# EAGLE design Adapter-TenX-CurrentSink (EAGLE 7.7.0)
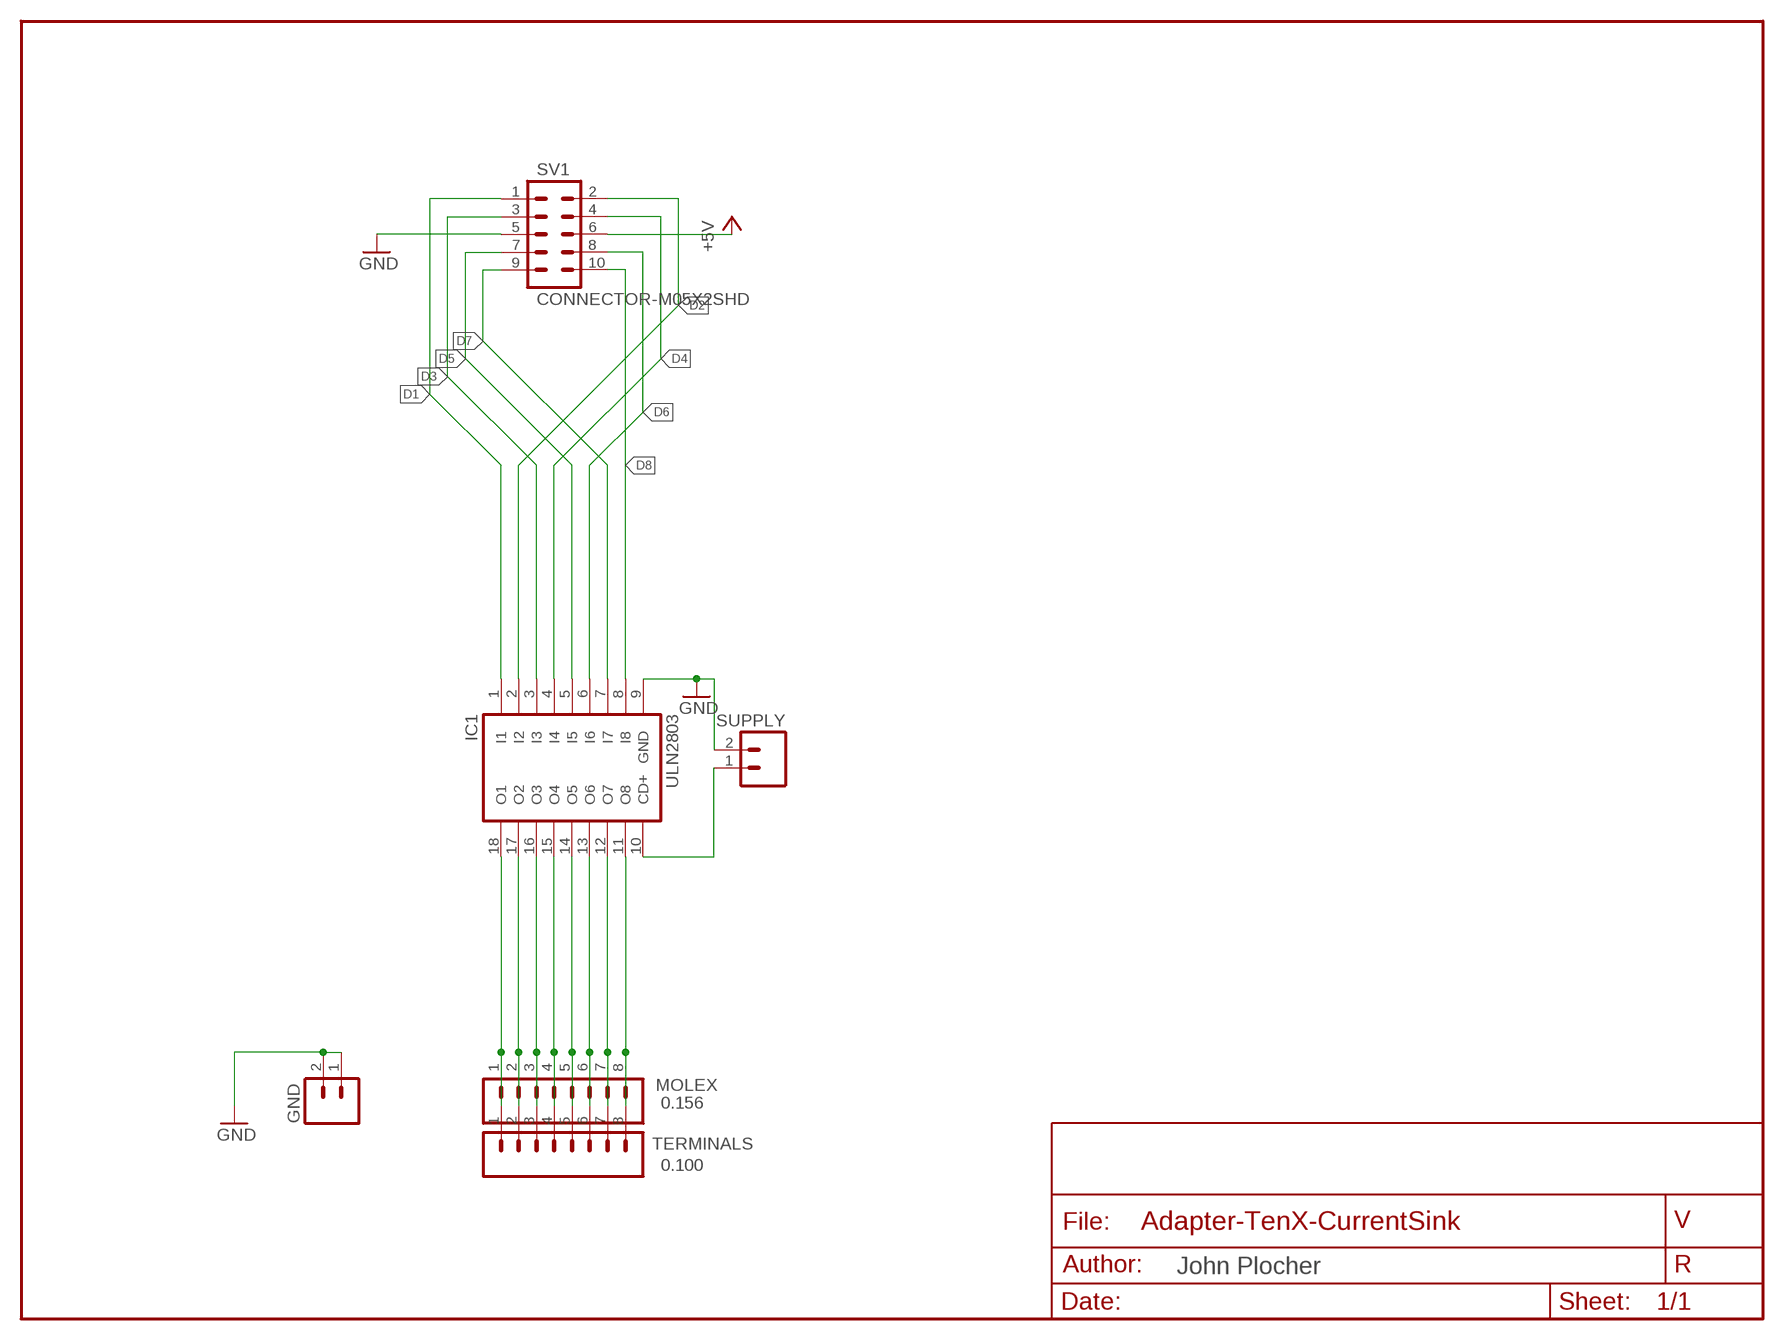
[diagram p0: schematic, sheet 1]

## Parts
GND  M02POLAR_LOCK  [MOLEX-1X2_LOCK]
IC1  ULN2803  ULN2803A  [DIL18]
MOLEX  0.156  CONNECTOR-M081.56-M  [KK-156-8-M]
SUPPLY  M02POLAR_LOCK  [MOLEX-1X2_LOCK]
SV1  CONNECTOR-M05X2SHD  [2X5-SHROUDED]
TERMINALS  0.100  CONNECTOR-M08LOCK_LONGPADS  [1X08_LOCK_LONGPADS]

## Nets
+5V: SV1.6
D1: IC1.1(I1) SV1.1
D2: IC1.2(I2) SV1.2
D3: IC1.3(I3) SV1.3
D4: IC1.4(I4) SV1.4
D5: IC1.5(I5) SV1.7
D6: IC1.6(I6) SV1.8
D7: IC1.7(I7) SV1.9
D8: IC1.8(I8) SV1.10
GND: GND.1 GND.2 IC1.9(GND) SUPPLY.2 SV1.5
N$1: IC1.10(CD+) SUPPLY.1
N$9: IC1.18(O1) MOLEX.1 TERMINALS.1
N$10: IC1.17(O2) MOLEX.2 TERMINALS.2
N$11: IC1.16(O3) MOLEX.3 TERMINALS.3
N$12: IC1.15(O4) MOLEX.4 TERMINALS.4
N$13: IC1.14(O5) MOLEX.5 TERMINALS.5
N$14: IC1.13(O6) MOLEX.6 TERMINALS.6
N$15: IC1.12(O7) MOLEX.7 TERMINALS.7
N$16: IC1.11(O8) MOLEX.8 TERMINALS.8

## Library data of the parts
GND SUPPLY = SparkFun:M02: Header 2 Standard 2-pin 0.1" header. Use with straight break away headers (SKU : PRT-00116), right angle break away headers (PRT-00553), swiss pins (PRT-00743), machine pins (PRT-00117), and female headers (PRT-00115). Molex polarized connector foot print use with SKU : PRT-08233 with associated crimp pins and housings.
IC1 = uln-udn:ULN2803A: DRIVER ARRAY
MOLEX TERMINALS = SPCoast:CONNECTOR-M08: Header 8 Standard 8-pin 0.1" header. Use with straight break away headers (SKU : PRT-00116), right angle break away headers (PRT-00553), swiss pins (PRT-00743), machine pins (PRT-00117), and female headers (PRT-00115).
SV1 = SPCoast:CONNECTOR-M05X2: Header 5x2 Standard 10-pin dual row 0.1" header. Commonly used with AVR-ISP. Use with Spark Fun Electronics SKU: PRT-00778

## Board
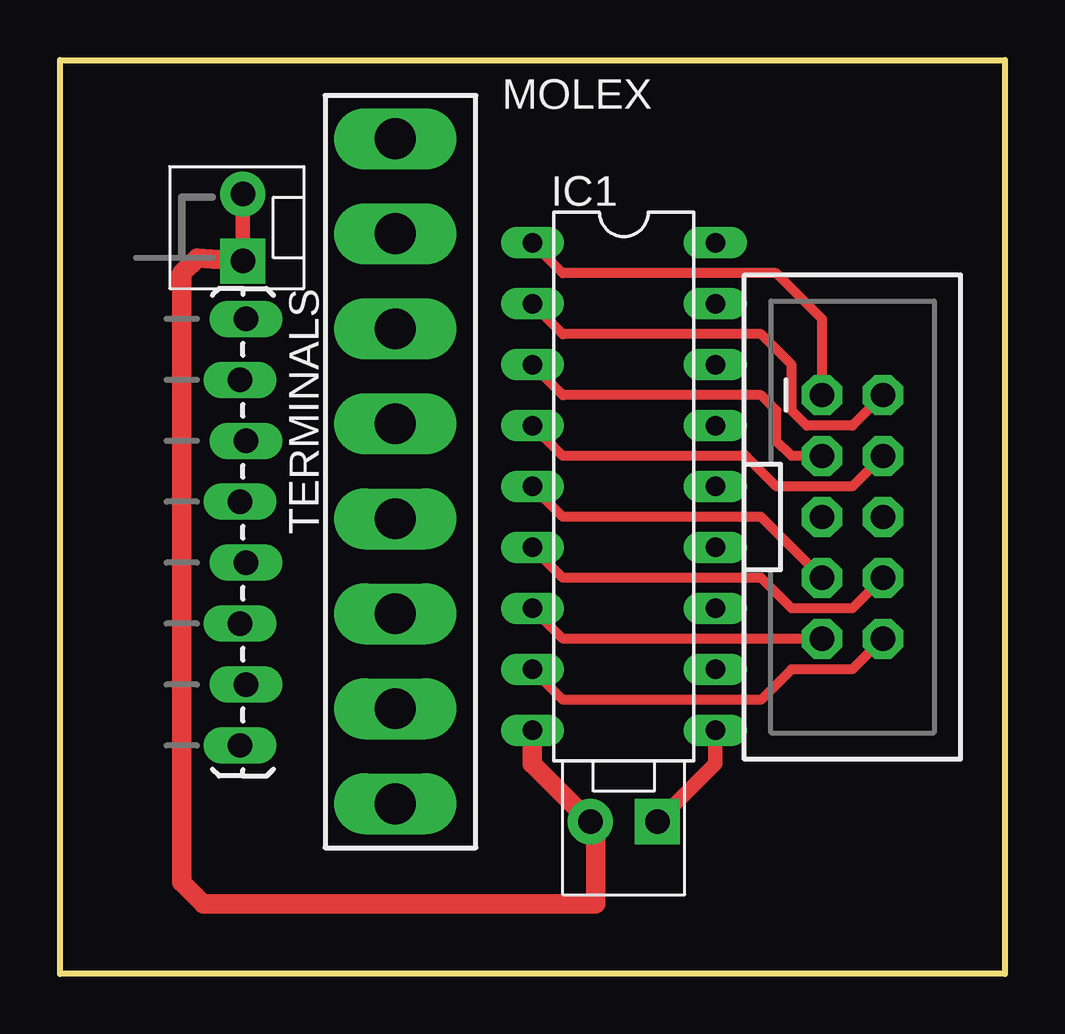
[diagram p1: board, top side]
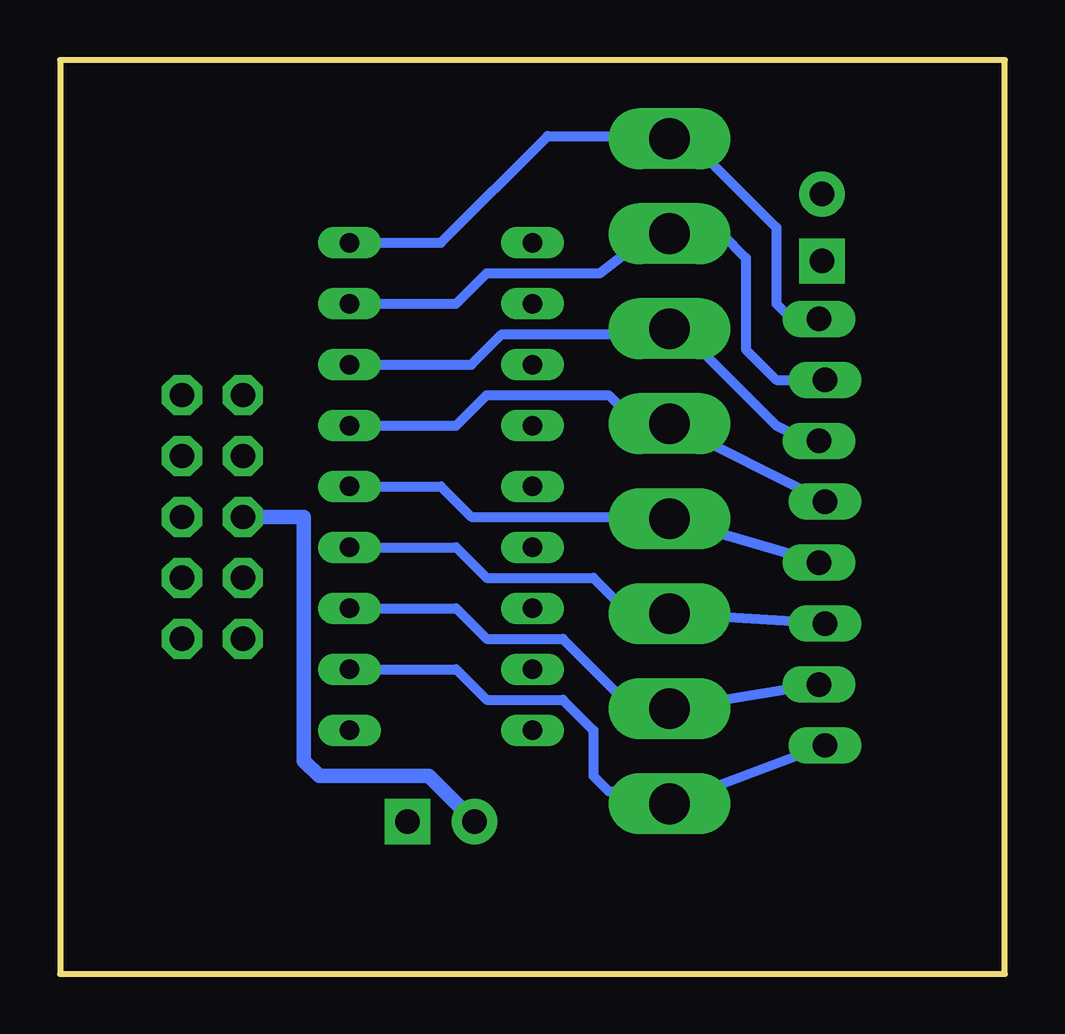
[diagram p2: board, bottom side, seen from below]

Size 39.37 x 38.1 mm. Coordinates in mm from the lower left corner, seen from the top.
Outline: 0,0 0,38.1 39.37,38.1 39.37,0 0,0
Copper layers (1*16): Top 0.035mm / dielectric 1.5mm / Bottom 0.035mm
Design rules "default": minimum track width 10mil, minimum drill 0.6mm, track to track 8mil, track to pad 8mil, pad to pad 8mil, via to via 8mil, smd to smd 8mil, copper to edge 40mil, drill to drill 8mil, minimum pad ring 10mil, minimum via ring 8mil, stop-mask expansion 4mil, vias tented up to drill 0mil, thermal gap 10mil

### Footprints (pad centres in the part's own frame; a part is rotated, then mirrored left to right if it is on the bottom)
MOLEX-1X2_LOCK = drill 1.016 pad 1.88 square: 1 -0.127,0 | drill 1.016 pad 1.88: 2 2.667,0
DIL18 = drill 0.813 long: 1 -10.16,-3.81; 2 -7.62,-3.81; 3 -5.08,-3.81; 4 -2.54,-3.81; 5 0,-3.81; 6 2.54,-3.81; 7 5.08,-3.81; 8 7.62,-3.81; 9 10.16,-3.81; 10 10.16,3.81; 11 7.62,3.81; 12 5.08,3.81; 13 2.54,3.81; 14 0,3.81; 15 -2.54,3.81; 16 -5.08,3.81; 17 -7.62,3.81; 18 -10.16,3.81
KK-156-8-M = drill 1.7 pad 2.184 long: 1 -13.86,0; 2 -9.9,0; 3 -5.94,0; 4 -1.98,0; 5 1.98,0; 6 5.94,0; 7 9.9,0; 8 13.86,0
2X5-SHROUDED = drill 1.016 pad 1.676 octagon: 1 -1.27,5.08; 2 1.27,5.08; 3 -1.27,2.54; 4 1.27,2.54; 5 -1.27,0; 6 1.27,0; 7 -1.27,-2.54; 8 1.27,-2.54; 9 -1.27,-5.08; 10 1.27,-5.08
1X08_LOCK_LONGPADS = drill 1.016 long: 1 0,0.127; 2 2.54,-0.127; 3 5.08,0.127; 4 7.62,-0.127; 5 10.16,0.127; 6 12.7,-0.127; 7 15.24,0.127; 8 17.78,-0.127

### Placement (x,y rotation side)
GND  7.62,29.84 90 top
IC1  23.5,20.32 270 top
MOLEX  13.97,20.95 270 top
SUPPLY  24.77,6.35 180 top
SV1  33.02,19.05 0 top
TERMINALS  7.62,27.3 270 top

### Tracks (layer width: path | path; a pad name or v marks a point on that pad's centre or on a via)
D1
  Top 0.406: SV1.1 31.75,27.3 29.84,29.21 20.95,29.21 IC1.1
D2
  Top 0.406: SV1.2 33.02,22.86 31.11,22.86 30.48,23.5 30.48,25.4 29.21,26.67 20.95,26.67 IC1.2
D3
  Top 0.406: SV1.3 30.48,21.59 29.84,22.23 29.84,23.5 29.21,24.13 20.95,24.13 IC1.3
D4
  Top 0.406: SV1.4 33.02,20.32 29.84,20.32 28.57,21.59 20.95,21.59 IC1.4
D5
  Top 0.406: SV1.7 29.21,19.05 20.95,19.05 IC1.5
D6
  Top 0.406: SV1.8 33.02,15.24 30.48,15.24 29.21,16.51 20.95,16.51 IC1.6
D7
  Top 0.406: SV1.9 20.95,13.97 IC1.7
D8
  Top 0.406: SV1.10 33.02,12.7 30.48,12.7 29.21,11.43 20.95,11.43 IC1.8
GND
  Top 0.61: GND.2 GND.1 | 22.32,6.12 SUPPLY.2
  Top 0.813: GND.1 5.71,29.84 5.08,29.21 5.08,3.81 5.97,2.92 22.32,2.92 22.32,6.12 | IC1.9 19.68,8.76 SUPPLY.2
  Bottom 0.61: SV1.5 29.21,19.05 29.21,8.89 28.57,8.26 24,8.26 SUPPLY.2
N$1
  Top 0.61: IC1.10 27.3,8.76 SUPPLY.1
N$9
  Bottom 0.406: IC1.18 23.5,30.48 19.05,34.92 14.08,34.92 MOLEX.1 13.22,34.81 9.53,31.11 9.53,27.94 8.89,27.3 TERMINALS.1
N$10
  Bottom 0.406: TERMINALS.2 9.53,24.77 10.79,26.04 10.79,29.84 11.8,30.86 MOLEX.2 14.87,30.86 15.24,30.48 16.89,29.21 21.59,29.21 22.86,27.94 IC1.17
N$11
  Bottom 0.406: TERMINALS.3 8.26,22.23 9.53,22.86 12.93,26.26 MOLEX.3 14.2,26.67 20.95,26.67 22.23,25.4 IC1.16
N$12
  Bottom 0.406: TERMINALS.4 MOLEX.4 15.24,22.86 16.51,24.13 21.59,24.13 22.86,22.86 IC1.15
N$13
  Bottom 0.406: TERMINALS.5 MOLEX.5 14.04,19.05 22.23,19.05 23.5,20.32 IC1.14
N$14
  Bottom 0.406: TERMINALS.6 MOLEX.6 14.38,14.61 15.24,14.61 17.14,16.51 21.59,16.51 22.86,17.78 IC1.13
N$15
  Bottom 0.406: 7.62,12.06 TERMINALS.7 MOLEX.7 14.35,11.43 15.88,11.43 18.41,13.97 21.59,13.97 22.86,15.24 IC1.12
N$16
  Bottom 0.406: TERMINALS.8 MOLEX.8 14.49,7.62 16.51,7.62 17.14,8.26 17.14,10.16 18.41,11.43 21.59,11.43 22.86,12.7 IC1.11

### Text on the board
tDocu: WH-CSNK | GND | v1.0 | MRCS | D1 | D2 | D3 | D4 | D5 | D6 | D7 | D8 | Vin | 5-48VDC | GND | - + | COM